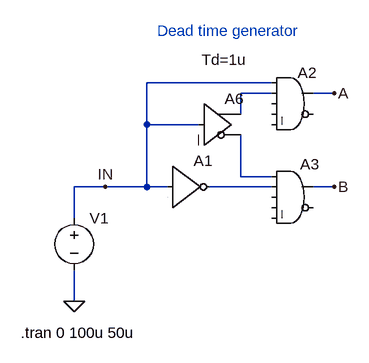
[diagram p0: schematic Dead-time.asc]
Dead-time.asc, the LTspice schematic file:
Version 4
SHEET 1 880 680
WIRE 256 32 64 32
WIRE 256 48 208 48
WIRE 352 48 320 48
WIRE 208 80 208 48
WIRE 64 96 64 32
WIRE 144 96 64 96
WIRE 208 176 208 112
WIRE 256 176 208 176
WIRE 0 192 -48 192
WIRE 64 192 64 96
WIRE 64 192 0 192
WIRE 96 192 64 192
WIRE 256 192 160 192
WIRE 352 192 320 192
WIRE -48 240 -48 192
WIRE -48 368 -48 320
FLAG 352 48 A
FLAG 352 192 B
FLAG -48 368 0
FLAG 0 192 IN
SYMBOL Digital\\inv 96 128 R0
WINDOW 3 0 0 Invisible 0
SYMATTR InstName A1
SYMATTR Value Vhigh=10 Td=0.01u
SYMBOL voltage -48 224 R0
WINDOW 3 -173 189 Invisible 0
WINDOW 123 0 0 Left 0
WINDOW 39 0 0 Left 0
SYMATTR InstName V1
SYMATTR Value PULSE(0 10 0 0.01u 0.01u 10u 20u)
SYMBOL Digital\\and 288 0 R0
WINDOW 3 -70 -9 Invisible 0
SYMATTR InstName A2
SYMATTR Value Vhigh=10
SYMATTR Value2 tripdt=20n
SYMBOL Digital\\and 288 144 R0
WINDOW 0 12 13 Left 0
WINDOW 3 -54 132 Invisible 0
SYMATTR InstName A3
SYMATTR Value Vhigh=10
SYMATTR Value2 tripdt=20n
SYMBOL Digital\\buf 144 32 R0
WINDOW 3 4 -36 Left 0
SYMATTR InstName A6
SYMATTR Value Td=1u
SYMATTR Value2 Vhigh=10
TEXT -130 416 Left 0 !.tran 0 100u 50u
TEXT 80 -48 Left 0 ;Dead time generator

The netlist it stands for:
* Dead-time.asc
A1 IN 0 0 0 0 N003 0 0 BUF Vhigh=10 Td=0.01u
V1 IN 0 PULSE(0 10 0 0.01u 0.01u 10u 20u)
A2 IN N001 0 0 0 0 A 0 AND Vhigh=10 tripdt=20n
A3 N002 N003 0 0 0 0 B 0 AND Vhigh=10 tripdt=20n
A6 IN 0 0 0 0 N002 N001 0 BUF Td=1u Vhigh=10
.tran 0 100u 50u
* Dead time generator
.backanno
.end